# EAGLE schematic controller (EAGLE 9.6.2)

## Sheet 1 of 3
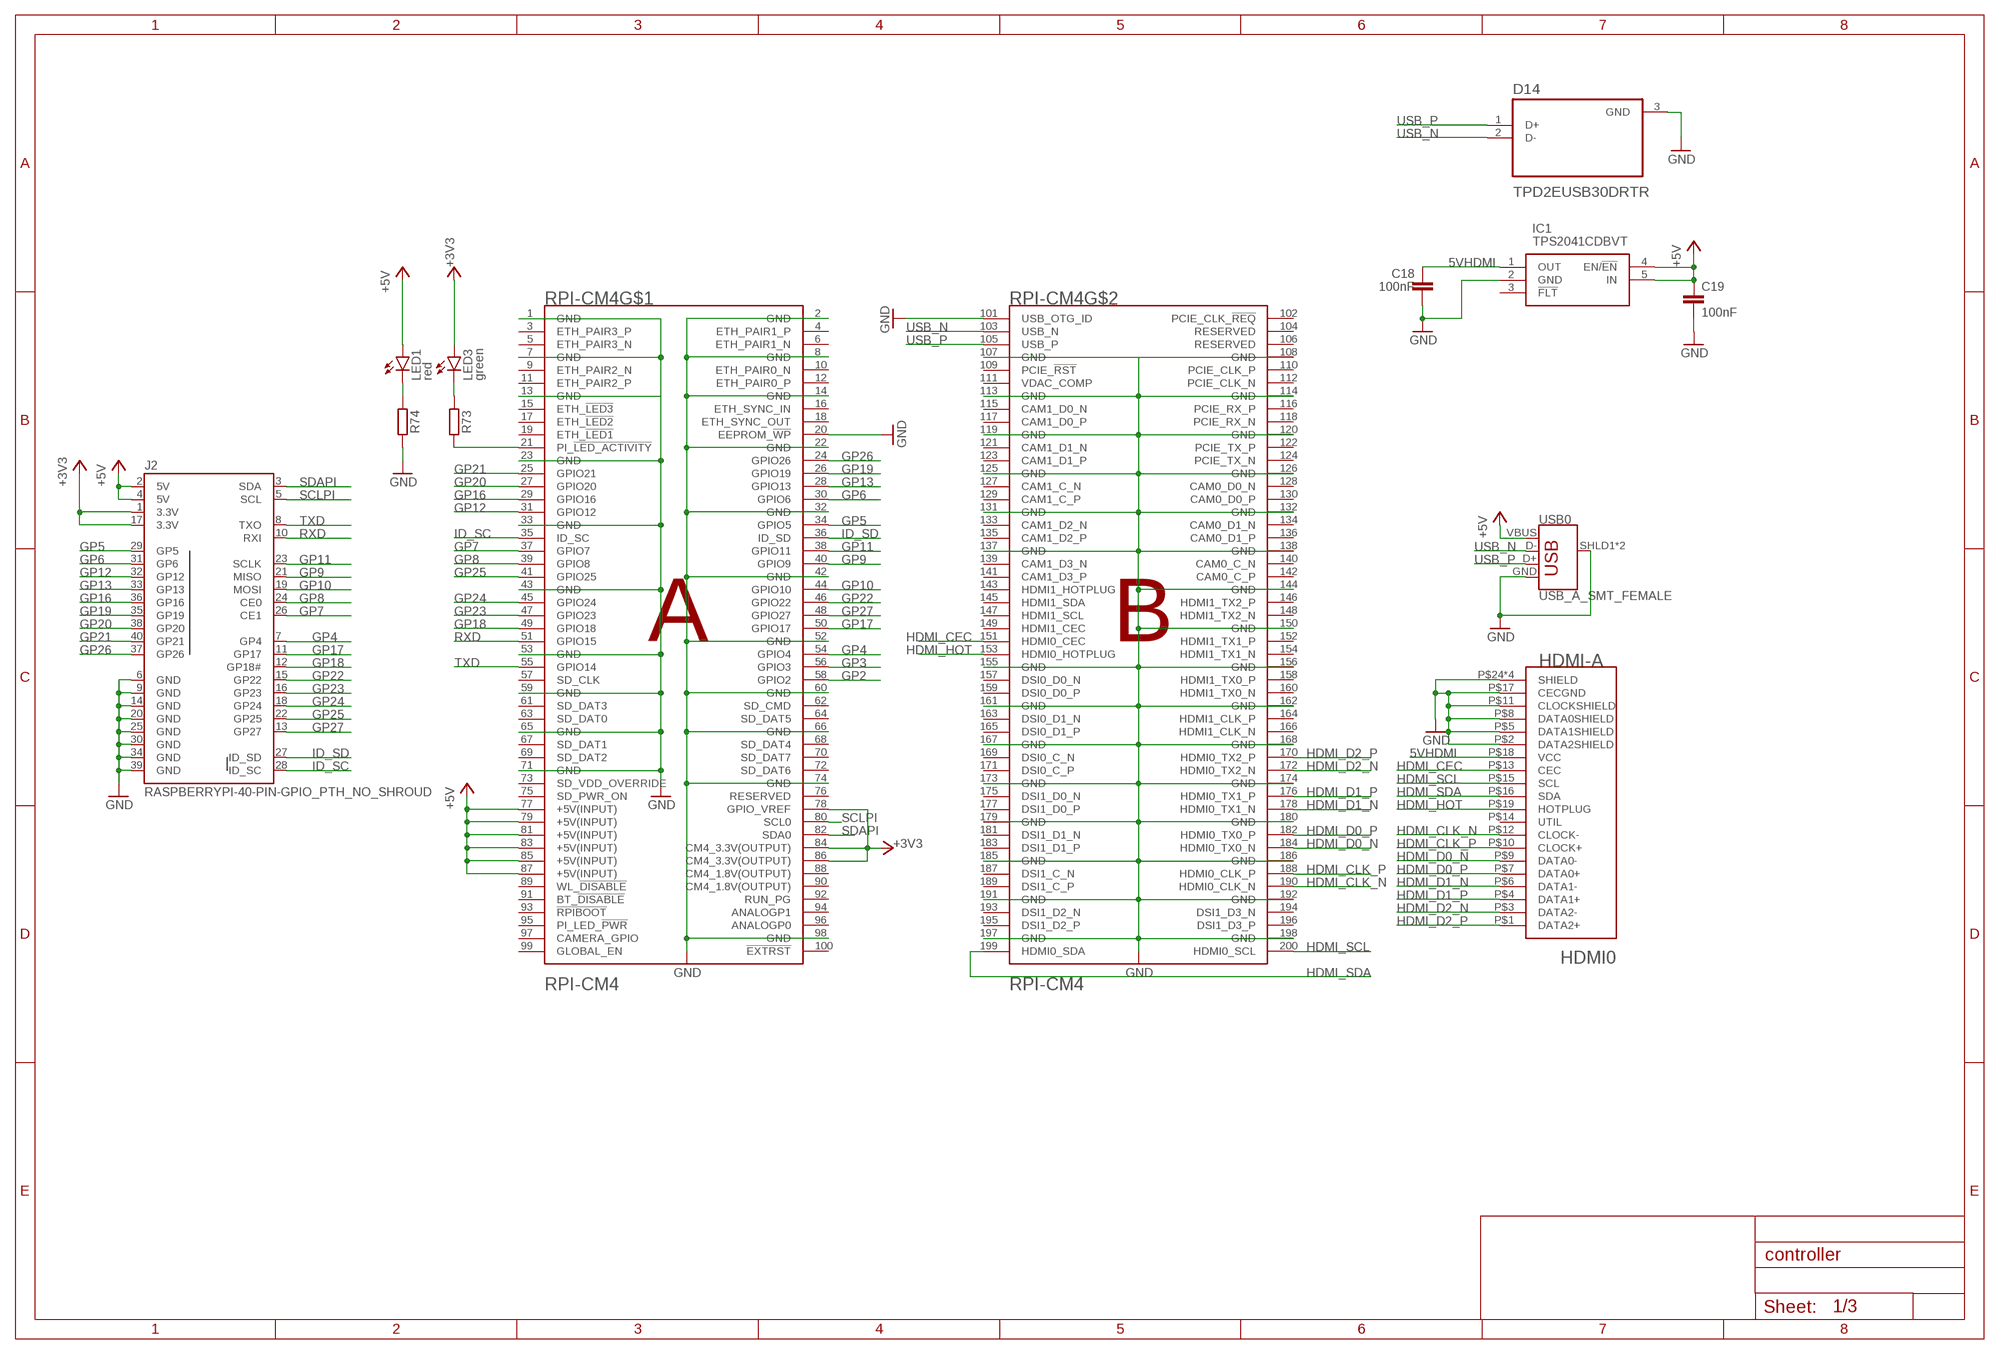
[diagram p0: schematic, sheet 1]

### Parts
C18  100nF  C-EUC0805  [C0805]
C19  100nF  C-EUC0805  [C0805]
D14  TPD2EUSB30DRTR  [SOTFL35P100X50-3N]
HDMI0  HDMI-A  [HDMI_A]
IC1  TPS2041CDBVT  [SOT95P280X145-5N]
J2  RASPBERRYPI-40-PIN-GPIO_PTH_NO_SHROUD  [2X20]
LED1  red  LEDCHIP-LED0805  [CHIP-LED0805]
LED3  green  LEDCHIP-LED0805  [CHIP-LED0805]
R73  1k  R-EU_R0805  [R0805]
R74  1k  R-EU_R0805  [R0805]
RPI-CM4  RPI-CM4  [RPI-CM4]
USB0  USB_A_SMT_FEMALE  [USB-A-S-SILK-FEMALE]

### Nets
5VHDMI: C18.1 HDMI0.P$18(VCC) IC1.1(OUT)
+3V3: J2.1(3.3V) J2.17(3.3V) LED3.A RPI-CM4.78(GPIO_VREF) RPI-CM4.84(CM4_3.3V(OUTPUT)) RPI-CM4.86(CM4_3.3V(OUTPUT)) ; also sheet 3
+5V: C19.1 IC1.4(EN/!EN) IC1.5(IN) J2.2(5V) J2.4(5V) LED1.A RPI-CM4.77(+5V(INPUT)) RPI-CM4.79(+5V(INPUT)) RPI-CM4.81(+5V(INPUT)) RPI-CM4.83(+5V(INPUT)) RPI-CM4.85(+5V(INPUT)) RPI-CM4.87(+5V(INPUT)) USB0.VBUS ; also sheet 2,3
GND: C18.2 C19.2 D14.3(GND) HDMI0.P$2(DATA2SHIELD) HDMI0.P$5(DATA1SHIELD) HDMI0.P$8(DATA0SHIELD) HDMI0.P$11(CLOCKSHIELD) HDMI0.P$17(CECGND) HDMI0.P$24(SHIELD) HDMI0.P$25(SHIELD) HDMI0.P$26(SHIELD) HDMI0.P$27(SHIELD) IC1.2(GND) J2.6(GND) J2.9(GND) J2.14(GND) J2.20(GND) J2.25(GND) J2.30(GND) J2.34(GND) J2.39(GND) R74.2 RPI-CM4.1(GND) RPI-CM4.2(GND) RPI-CM4.7(GND) RPI-CM4.8(GND) RPI-CM4.13(GND) RPI-CM4.14(GND) RPI-CM4.20(EEPROM_!WP) RPI-CM4.22(GND) RPI-CM4.23(GND) RPI-CM4.32(GND) RPI-CM4.33(GND) RPI-CM4.42(GND) RPI-CM4.43(GND) RPI-CM4.52(GND) RPI-CM4.53(GND) RPI-CM4.59(GND) RPI-CM4.60(GND) RPI-CM4.65(GND) RPI-CM4.66(GND) RPI-CM4.71(GND) RPI-CM4.74(GND) RPI-CM4.98(GND) RPI-CM4.101(USB_OTG_ID) RPI-CM4.107(GND) RPI-CM4.108(GND) RPI-CM4.113(GND) RPI-CM4.114(GND) RPI-CM4.119(GND) RPI-CM4.120(GND) RPI-CM4.125(GND) RPI-CM4.126(GND) RPI-CM4.131(GND) RPI-CM4.132(GND) RPI-CM4.137(GND) RPI-CM4.138(GND) RPI-CM4.144(GND) RPI-CM4.150(GND) RPI-CM4.155(GND) RPI-CM4.156(GND) RPI-CM4.161(GND) RPI-CM4.162(GND) RPI-CM4.167(GND) RPI-CM4.168(GND) RPI-CM4.173(GND) RPI-CM4.174(GND) RPI-CM4.179(GND) RPI-CM4.180(GND) RPI-CM4.185(GND) RPI-CM4.186(GND) RPI-CM4.191(GND) RPI-CM4.192(GND) RPI-CM4.197(GND) RPI-CM4.198(GND) USB0.GND USB0.SHLD1(SHIELD) USB0.SHLD2(SHIELD) ; also sheet 2,3
GP2: RPI-CM4.58(GPIO2)
GP3: RPI-CM4.56(GPIO3)
GP4: J2.7(GP4) RPI-CM4.54(GPIO4)
GP5: J2.29(GP5) RPI-CM4.34(GPIO5)
GP6: J2.31(GP6) RPI-CM4.30(GPIO6)
GP7: J2.26(CE1) RPI-CM4.37(GPIO7)
GP8: J2.24(CE0) RPI-CM4.39(GPIO8)
GP9: J2.21(MISO) RPI-CM4.40(GPIO9)
GP10: J2.19(MOSI) RPI-CM4.44(GPIO10)
GP11: J2.23(SCLK) RPI-CM4.38(GPIO11)
GP12: J2.32(GP12) RPI-CM4.31(GPIO12)
GP13: J2.33(GP13) RPI-CM4.28(GPIO13)
GP16: J2.36(GP16) RPI-CM4.29(GPIO16)
GP17: J2.11(GP17) RPI-CM4.50(GPIO17)
GP18: J2.12(GP18#) RPI-CM4.49(GPIO18)
GP19: J2.35(GP19) RPI-CM4.26(GPIO19)
GP20: J2.38(GP20) RPI-CM4.27(GPIO20)
GP21: J2.40(GP21) RPI-CM4.25(GPIO21)
GP22: J2.15(GP22) RPI-CM4.46(GPIO22)
GP23: J2.16(GP23) RPI-CM4.47(GPIO23) ; also sheet 3
GP24: J2.18(GP24) RPI-CM4.45(GPIO24)
GP25: J2.22(GP25) RPI-CM4.41(GPIO25)
GP26: J2.37(GP26) RPI-CM4.24(GPIO26)
GP27: J2.13(GP27) RPI-CM4.48(GPIO27)
HDMI_CEC: HDMI0.P$13(CEC) RPI-CM4.151(HDMI0_CEC)
HDMI_CLK_N [HDMI]: HDMI0.P$12(CLOCK-) RPI-CM4.190(HDMI0_CLK_N)
HDMI_CLK_P [HDMI]: HDMI0.P$10(CLOCK+) RPI-CM4.188(HDMI0_CLK_P)
HDMI_D0_N [HDMI]: HDMI0.P$9(DATA0-) RPI-CM4.184(HDMI0_TX0_N)
HDMI_D0_P [HDMI]: HDMI0.P$7(DATA0+) RPI-CM4.182(HDMI0_TX0_P)
HDMI_D1_N [HDMI]: HDMI0.P$6(DATA1-) RPI-CM4.178(HDMI0_TX1_N)
HDMI_D1_P [HDMI]: HDMI0.P$4(DATA1+) RPI-CM4.176(HDMI0_TX1_P)
HDMI_D2_N [HDMI]: HDMI0.P$3(DATA2-) RPI-CM4.172(HDMI0_TX2_N)
HDMI_D2_P [HDMI]: HDMI0.P$1(DATA2+) RPI-CM4.170(HDMI0_TX2_P)
HDMI_HOT: HDMI0.P$19(HOTPLUG) RPI-CM4.153(HDMI0_HOTPLUG)
HDMI_SCL: HDMI0.P$15(SCL) RPI-CM4.200(HDMI0_SCL)
HDMI_SDA: HDMI0.P$16(SDA) RPI-CM4.199(HDMI0_SDA)
ID_SC: J2.28(ID_SC) RPI-CM4.35(ID_SC)
ID_SD: J2.27(ID_SD) RPI-CM4.36(ID_SD)
N$4: R73.2 RPI-CM4.21(PI_!LED_ACTIVITY)
N$23: LED3.C R73.1
N$32: LED1.C R74.1
RXD: J2.10(RXI) RPI-CM4.51(GPIO15) ; also sheet 3
SCLPI: J2.5(SCL) RPI-CM4.80(SCL0)
SDAPI: J2.3(SDA) RPI-CM4.82(SDA0)
TXD: J2.8(TXO) RPI-CM4.55(GPIO14) ; also sheet 3
USB_N [USB]: D14.2(D-) RPI-CM4.103(USB_N) USB0.D-
USB_P [USB]: D14.1(D+) RPI-CM4.105(USB_P) USB0.D+
Unconnected: HDMI0.P$14(UTIL) IC1.3(!FLT) RPI-CM4.3(ETH_PAIR3_P) RPI-CM4.4(ETH_PAIR1_P) RPI-CM4.5(ETH_PAIR3_N) RPI-CM4.6(ETH_PAIR1_N) RPI-CM4.9(ETH_PAIR2_N) RPI-CM4.10(ETH_PAIR0_N) RPI-CM4.11(ETH_PAIR2_P) RPI-CM4.12(ETH_PAIR0_P) RPI-CM4.15(ETH_!LED3) RPI-CM4.16(ETH_SYNC_IN) RPI-CM4.17(ETH_!LED2) RPI-CM4.18(ETH_SYNC_OUT) RPI-CM4.19(ETH_!LED1) RPI-CM4.57(SD_CLK) RPI-CM4.61(SD_DAT3) RPI-CM4.62(SD_CMD) RPI-CM4.63(SD_DAT0) RPI-CM4.64(SD_DAT5) RPI-CM4.67(SD_DAT1) RPI-CM4.68(SD_DAT4) RPI-CM4.69(SD_DAT2) RPI-CM4.70(SD_DAT7) RPI-CM4.72(SD_DAT6) RPI-CM4.73(SD_VDD_OVERRIDE) RPI-CM4.75(SD_PWR_ON) RPI-CM4.76(RESERVED) RPI-CM4.88(CM4_1.8V(OUTPUT)) RPI-CM4.89(WL_!DISABLE) RPI-CM4.90(CM4_1.8V(OUTPUT)) RPI-CM4.91(BT_!DISABLE) RPI-CM4.92(RUN_PG) RPI-CM4.93(!RPIBOOT) RPI-CM4.94(ANALOGP1) RPI-CM4.95(PI_LED_!PWR) RPI-CM4.96(ANALOGP0) RPI-CM4.97(CAMERA_GPIO) RPI-CM4.99(GLOBAL_EN) RPI-CM4.100(!EXTRST) RPI-CM4.102(PCIE_CLK_!REQ) RPI-CM4.104(RESERVED) RPI-CM4.106(RESERVED) RPI-CM4.109(PCIE_!RST) RPI-CM4.110(PCIE_CLK_P) RPI-CM4.111(VDAC_COMP) RPI-CM4.112(PCIE_CLK_N) RPI-CM4.115(CAM1_D0_N) RPI-CM4.116(PCIE_RX_P) RPI-CM4.117(CAM1_D0_P) RPI-CM4.118(PCIE_RX_N) RPI-CM4.121(CAM1_D1_N) RPI-CM4.122(PCIE_TX_P) RPI-CM4.123(CAM1_D1_P) RPI-CM4.124(PCIE_TX_N) RPI-CM4.127(CAM1_C_N) RPI-CM4.128(CAM0_D0_N) RPI-CM4.129(CAM1_C_P) RPI-CM4.130(CAM0_D0_P) RPI-CM4.133(CAM1_D2_N) RPI-CM4.134(CAM0_D1_N) RPI-CM4.135(CAM1_D2_P) RPI-CM4.136(CAM0_D1_P) RPI-CM4.139(CAM1_D3_N) RPI-CM4.140(CAM0_C_N) RPI-CM4.141(CAM1_D3_P) RPI-CM4.142(CAM0_C_P) RPI-CM4.143(HDMI1_HOTPLUG) RPI-CM4.145(HDMI1_SDA) RPI-CM4.146(HDMI1_TX2_P) RPI-CM4.147(HDMI1_SCL) RPI-CM4.148(HDMI1_TX2_N) RPI-CM4.149(HDMI1_CEC) RPI-CM4.152(HDMI1_TX1_P) RPI-CM4.154(HDMI1_TX1_N) RPI-CM4.157(DSI0_D0_N) RPI-CM4.158(HDMI1_TX0_P) RPI-CM4.159(DSI0_D0_P) RPI-CM4.160(HDMI1_TX0_N) RPI-CM4.163(DSI0_D1_N) RPI-CM4.164(HDMI1_CLK_P) RPI-CM4.165(DSI0_D1_P) RPI-CM4.166(HDMI1_CLK_N) RPI-CM4.169(DSI0_C_N) RPI-CM4.171(DSI0_C_P) RPI-CM4.175(DSI1_D0_N) RPI-CM4.177(DSI1_D0_P) RPI-CM4.181(DSI1_D1_N) RPI-CM4.183(DSI1_D1_P) RPI-CM4.187(DSI1_C_N) RPI-CM4.189(DSI1_C_P) RPI-CM4.193(DSI1_D2_N) RPI-CM4.194(DSI1_D3_N) RPI-CM4.195(DSI1_D2_P) RPI-CM4.196(DSI1_D3_P)

## Sheet 2 of 3
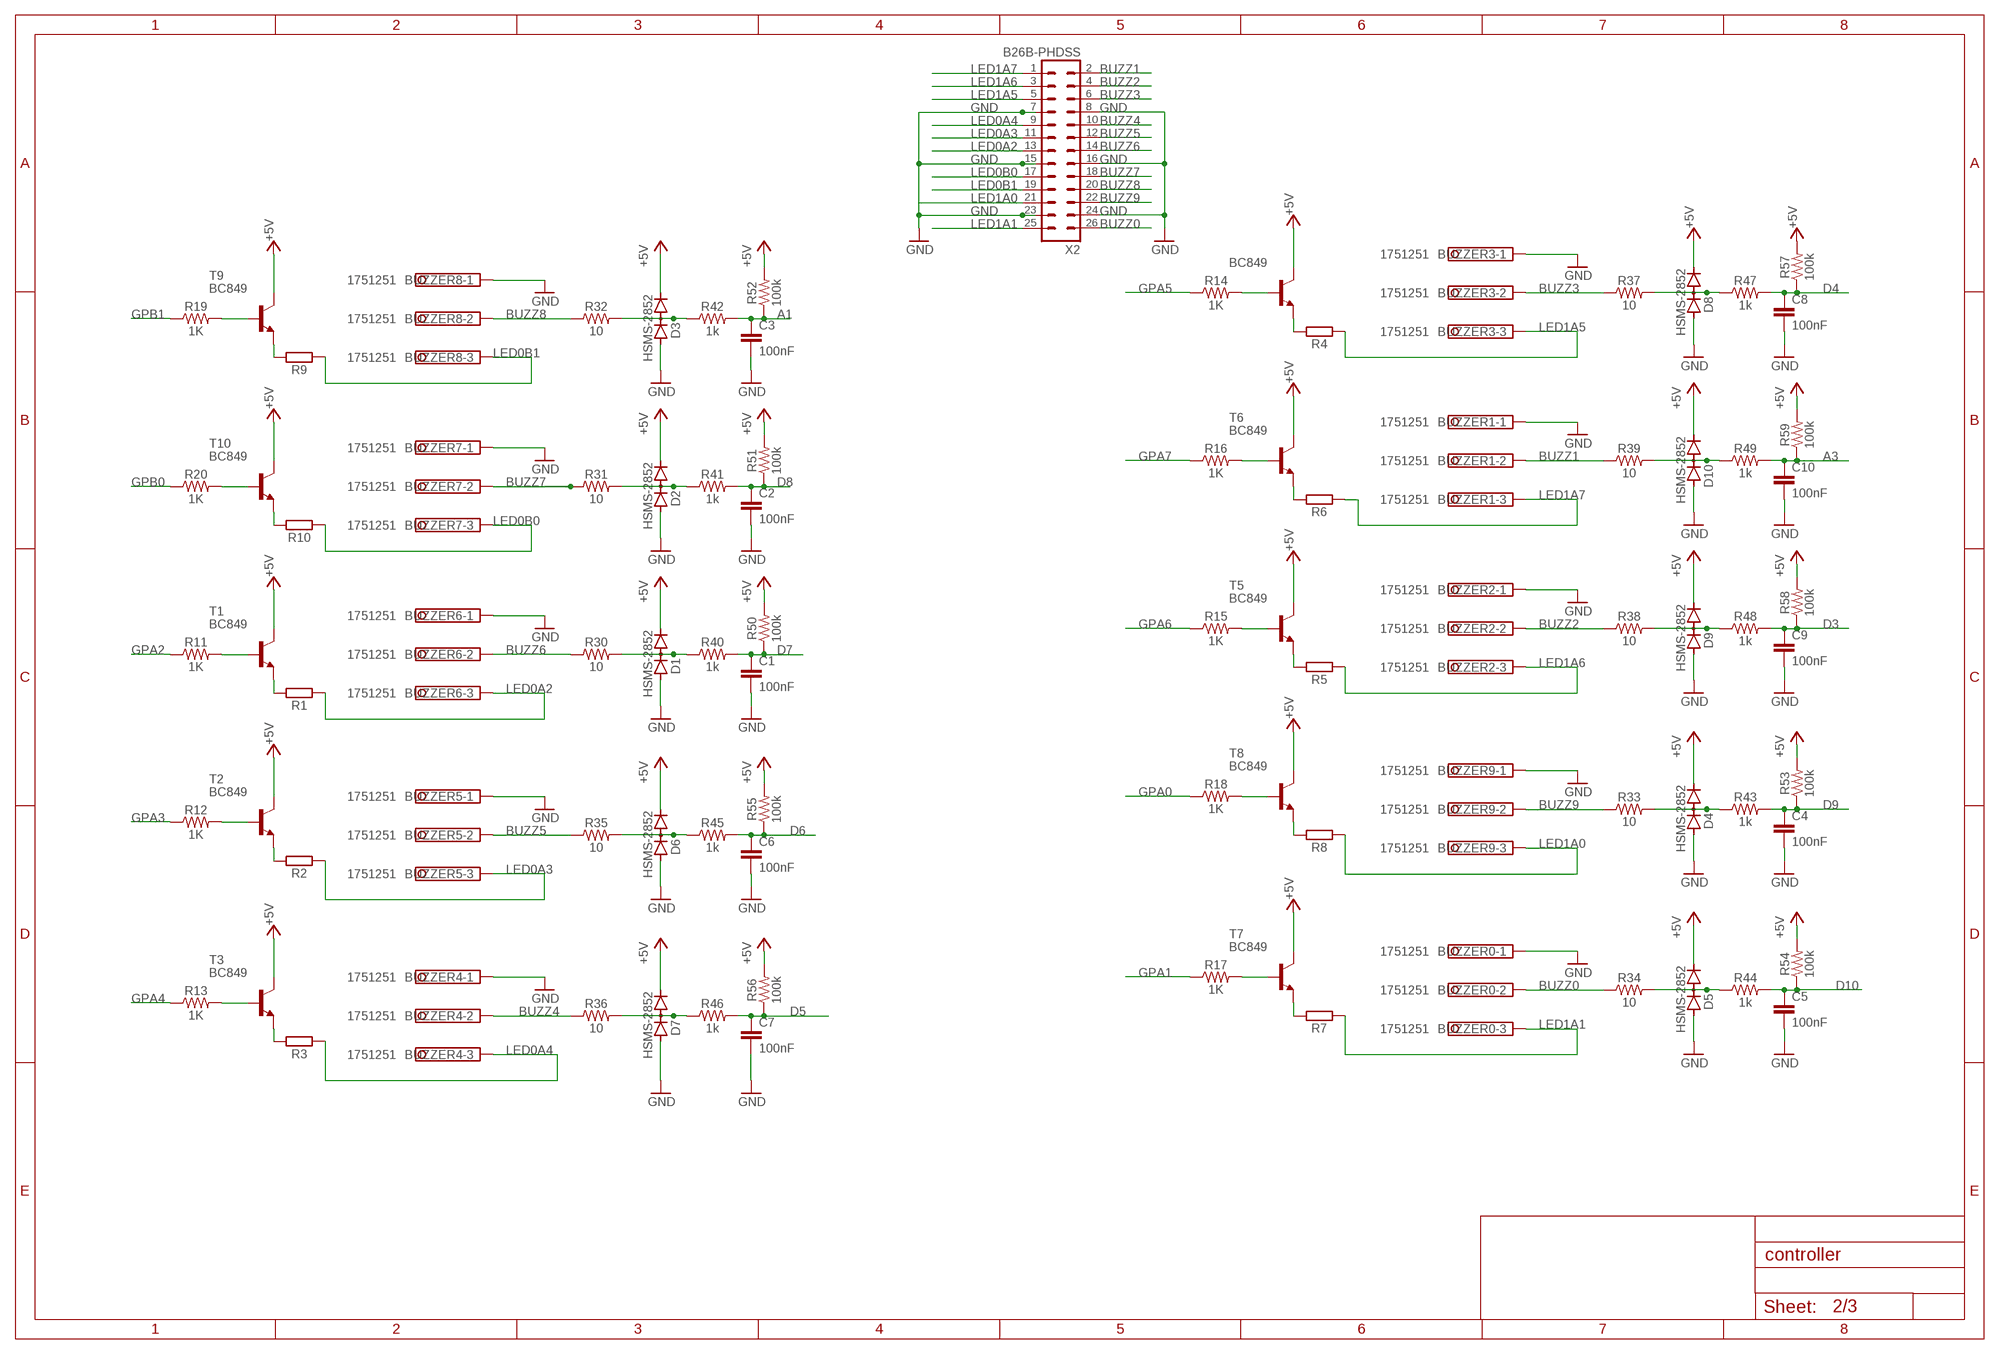
[diagram p1: schematic, sheet 2]

### Parts
BUZZER0  1751251  [1751251]
BUZZER1  1751251  [1751251]
BUZZER2  1751251  [1751251]
BUZZER3  1751251  [1751251]
BUZZER4  1751251  [1751251]
BUZZER5  1751251  [1751251]
BUZZER6  1751251  [1751251]
BUZZER7  1751251  [1751251]
BUZZER8  1751251  [1751251]
BUZZER9  1751251  [1751251]
C1  100nF  C-EUC0805  [C0805]
C2  100nF  C-EUC0805  [C0805]
C3  100nF  C-EUC0805  [C0805]
C4  100nF  C-EUC0805  [C0805]
C5  100nF  C-EUC0805  [C0805]
C6  100nF  C-EUC0805  [C0805]
C7  100nF  C-EUC0805  [C0805]
C8  100nF  C-EUC0805  [C0805]
C9  100nF  C-EUC0805  [C0805]
C10  100nF  C-EUC0805  [C0805]
D1  HSMS-2852  [SOT23]
D2  HSMS-2852  [SOT23]
D3  HSMS-2852  [SOT23]
D4  HSMS-2852  [SOT23]
D5  HSMS-2852  [SOT23]
D6  HSMS-2852  [SOT23]
D7  HSMS-2852  [SOT23]
D8  HSMS-2852  [SOT23]
D9  HSMS-2852  [SOT23]
D10  HSMS-2852  [SOT23]
R1  50  R-EU_R2512  [R2512]
R2  50  R-EU_R2512  [R2512]
R3  50  R-EU_R2512  [R2512]
R4  50  R-EU_R2512  [R2512]
R5  50  R-EU_R2512  [R2512]
R6  50  R-EU_R2512  [R2512]
R7  50  R-EU_R2512  [R2512]
R8  50  R-EU_R2512  [R2512]
R9  50  R-EU_R2512  [R2512]
R10  50  R-EU_R2512  [R2512]
R11  1K  RESISTOR0805  [0805]
R12  1K  RESISTOR0805  [0805]
R13  1K  RESISTOR0805  [0805]
R14  1K  RESISTOR0805  [0805]
R15  1K  RESISTOR0805  [0805]
R16  1K  RESISTOR0805  [0805]
R17  1K  RESISTOR0805  [0805]
R18  1K  RESISTOR0805  [0805]
R19  1K  RESISTOR0805  [0805]
R20  1K  RESISTOR0805  [0805]
R30  10  RESISTOR0805  [0805]
R31  10  RESISTOR0805  [0805]
R32  10  RESISTOR0805  [0805]
R33  10  RESISTOR0805  [0805]
R34  10  RESISTOR0805  [0805]
R35  10  RESISTOR0805  [0805]
R36  10  RESISTOR0805  [0805]
R37  10  RESISTOR0805  [0805]
R38  10  RESISTOR0805  [0805]
R39  10  RESISTOR0805  [0805]
R40  1k  RESISTOR0805  [0805]
R41  1k  RESISTOR0805  [0805]
R42  1k  RESISTOR0805  [0805]
R43  1k  RESISTOR0805  [0805]
R44  1k  RESISTOR0805  [0805]
R45  1k  RESISTOR0805  [0805]
R46  1k  RESISTOR0805  [0805]
R47  1k  RESISTOR0805  [0805]
R48  1k  RESISTOR0805  [0805]
R49  1k  RESISTOR0805  [0805]
R50  100k  RESISTOR0805  [0805]
R51  100k  RESISTOR0805  [0805]
R52  100k  RESISTOR0805  [0805]
R53  100k  RESISTOR0805  [0805]
R54  100k  RESISTOR0805  [0805]
R55  100k  RESISTOR0805  [0805]
R56  100k  RESISTOR0805  [0805]
R57  100k  RESISTOR0805  [0805]
R58  100k  RESISTOR0805  [0805]
R59  100k  RESISTOR0805  [0805]
T1  BC849  [SOT23]
T2  BC849  [SOT23]
T3  BC849  [SOT23]
T4  BC849  [SOT23]
T5  BC849  [SOT23]
T6  BC849  [SOT23]
T7  BC849  [SOT23]
T8  BC849  [SOT23]
T9  BC849  [SOT23]
T10  BC849  [SOT23]
X2  B26B-PHDSS  [B26B-PHDSS]

### Nets
+5V: D1.2(C) D2.2(C) D3.2(C) D4.2(C) D5.2(C) D6.2(C) D7.2(C) D8.2(C) D9.2(C) D10.2(C) R50.2 R51.2 R52.2 R53.2 R54.2 R55.2 R56.2 R57.2 R58.2 R59.2 T1.3(C) T2.3(C) T3.3(C) T4.3(C) T5.3(C) T6.3(C) T7.3(C) T8.3(C) T9.3(C) T10.3(C) ; also sheet 1,3
A1: C3.1 R42.2 R52.1 ; also sheet 3
A3: C10.1 R49.2 R59.1 ; also sheet 3
BUZZ0: BUZZER0.2 R34.1 X2.26
BUZZ1: BUZZER1.2 R39.1 X2.2
BUZZ2: BUZZER2.2 R38.1 X2.4
BUZZ3: BUZZER3.2 R37.1 X2.6
BUZZ4: BUZZER4.2 R36.1 X2.10
BUZZ5: BUZZER5.2 R35.1 X2.12
BUZZ6: BUZZER6.2 R30.1 X2.14
BUZZ7: BUZZER7.2 R31.1 X2.18
BUZZ8: BUZZER8.2 R32.1 X2.20
BUZZ9: BUZZER9.2 R33.1 X2.22
D3: C9.1 R48.2 R58.1 ; also sheet 3
D4: C8.1 R47.2 R57.1 ; also sheet 3
D5: C7.1 R46.2 R56.1 ; also sheet 3
D6: C6.1 R45.2 R55.1 ; also sheet 3
D7: C1.1 R40.2 R50.1 ; also sheet 3
D8: C2.1 R41.2 R51.1 ; also sheet 3
D9: C4.1 R43.2 R53.1 ; also sheet 3
D10: C5.1 R44.2 R54.1 ; also sheet 3
GND: BUZZER0.1 BUZZER1.1 BUZZER2.1 BUZZER3.1 BUZZER4.1 BUZZER5.1 BUZZER6.1 BUZZER7.1 BUZZER8.1 BUZZER9.1 C1.2 C2.2 C3.2 C4.2 C5.2 C6.2 C7.2 C8.2 C9.2 C10.2 D1.1(A) D2.1(A) D3.1(A) D4.1(A) D5.1(A) D6.1(A) D7.1(A) D8.1(A) D9.1(A) D10.1(A) X2.7 X2.8 X2.15 X2.16 X2.23 X2.24 ; also sheet 1,3
GPA0: R18.1 ; also sheet 3
GPA1: R17.1 ; also sheet 3
GPA2: R11.1 ; also sheet 3
GPA3: R12.1 ; also sheet 3
GPA4: R13.1 ; also sheet 3
GPA5: R14.1 ; also sheet 3
GPA6: R15.1 ; also sheet 3
GPA7: R16.1 ; also sheet 3
GPB0: R20.1 ; also sheet 3
GPB1: R19.1 ; also sheet 3
LED0A2: BUZZER6.3 R1.1 X2.13
LED0A3: BUZZER5.3 R2.1 X2.11
LED0A4: BUZZER4.3 R3.1 X2.9
LED0B0: BUZZER7.3 R10.1 X2.17
LED0B1: BUZZER8.3 R9.1 X2.19
LED1A0: BUZZER9.3 R8.1 X2.21
LED1A1: BUZZER0.3 R7.1 X2.25
LED1A5: BUZZER3.3 R4.1 X2.5
LED1A6: BUZZER2.3 R5.1 X2.3
LED1A7: BUZZER1.3 R6.1 X2.1
N$1: R14.2 T4.1(B)
N$2: R4.2 T4.2(E)
N$3: D3.3(AC) R32.2 R42.1
N$5: R16.2 T6.1(B)
N$6: D2.3(AC) R31.2 R41.1
N$7: D8.3(AC) R37.2 R47.1
N$8: R6.2 T6.2(E)
N$9: D1.3(AC) R30.2 R40.1
N$10: R15.2 T5.1(B)
N$11: R5.2 T5.2(E)
N$12: D6.3(AC) R35.2 R45.1
N$13: D10.3(AC) R39.2 R49.1
N$14: R18.2 T8.1(B)
N$15: D7.3(AC) R36.2 R46.1
N$16: R8.2 T8.2(E)
N$17: D9.3(AC) R38.2 R48.1
N$18: R17.2 T7.1(B)
N$19: D4.3(AC) R33.2 R43.1
N$20: R7.2 T7.2(E)
N$21: R19.2 T9.1(B)
N$22: R9.2 T9.2(E)
N$24: R20.2 T10.1(B)
N$25: R10.2 T10.2(E)
N$26: R11.2 T1.1(B)
N$27: R1.2 T1.2(E)
N$28: R12.2 T2.1(B)
N$29: R2.2 T2.2(E)
N$30: R13.2 T3.1(B)
N$31: R3.2 T3.2(E)
N$34: D5.3(AC) R34.2 R44.1

## Sheet 3 of 3
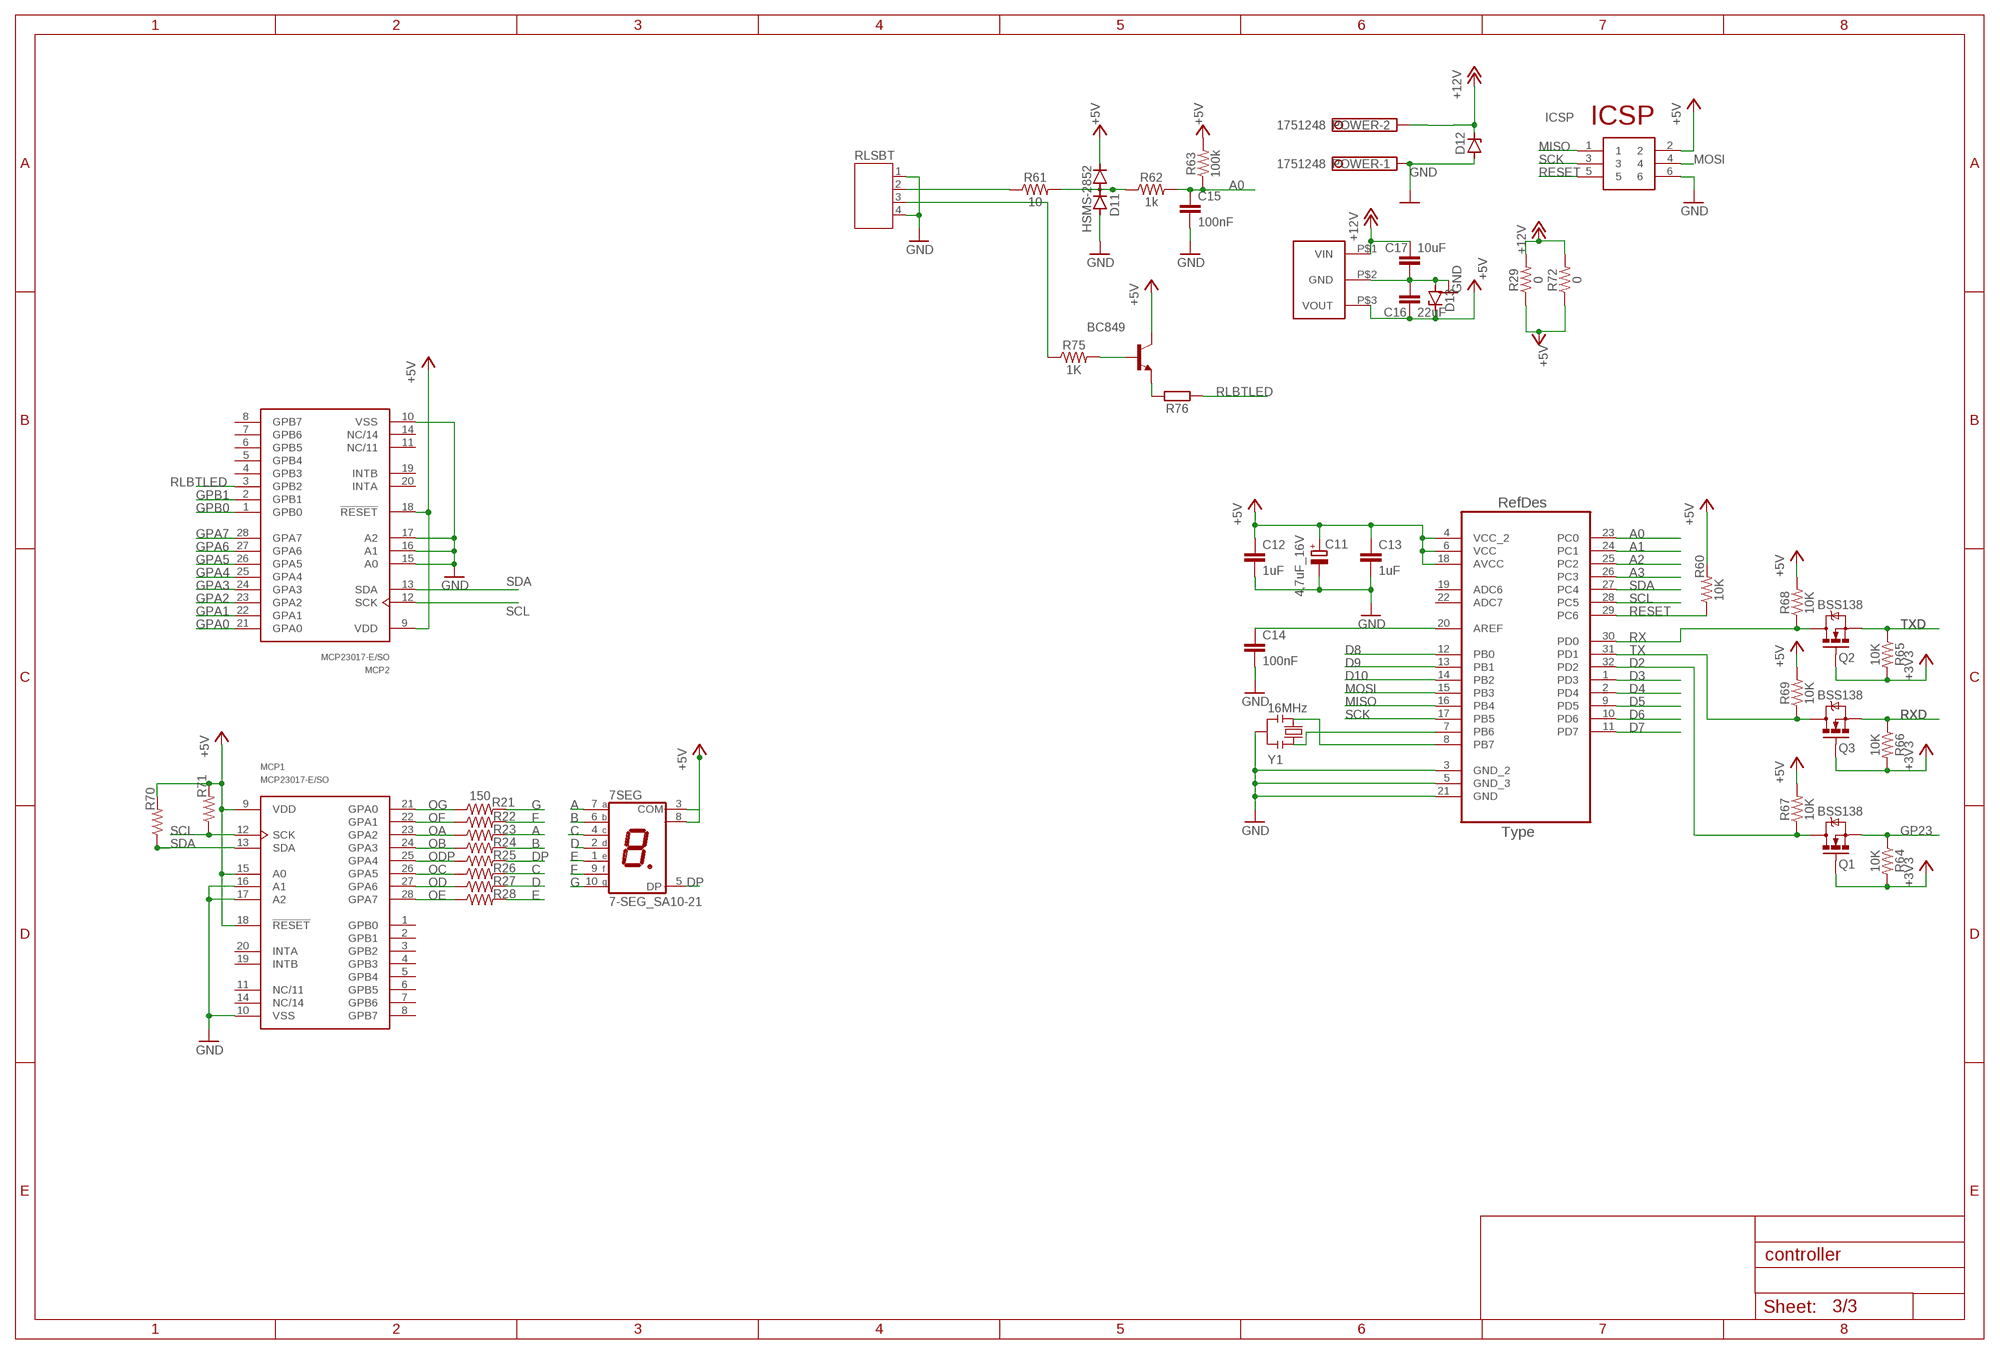
[diagram p2: schematic, sheet 3]

### Parts
7SEG  7-SEG_SA10-21  [SA10-21]
C11  4,7uF_16V  0833_TAJA475MO16RNJ  [TAN-A]
C12  1uF  0006_1UF_0603/GRM188R61E105KA12D  [C0603-ROUND]
C13  1uF  0006_1UF_0603/GRM188R61E105KA12D  [C0603-ROUND]
C14  100nF  0015_100NF_0603  [C0603-ROUND]
C15  100nF  C-EUC0805  [C0805]
C16  22uF  C-EUC0805  [C0805]
C17  10uF  C-EUC0805  [C0805]
D11  HSMS-2852  [SOT23]
D12  ZENER-DIODESMB  [SMB]
D13  ZENER-DIODESMB  [SMB]
ICSP  61200621621  [SHDR6W64P254_2X3_1528X910X910P]
MCP1  MCP23017-E/SO  [SOIC28]
MCP2  MCP23017-E/SO  [SOIC28]
POWER  1751248  [1751248]
Q1  BSS138  MOSFET-NCHANNELSMD  [SOT23-3]
Q2  BSS138  MOSFET-NCHANNELSMD  [SOT23-3]
Q3  BSS138  MOSFET-NCHANNELSMD  [SOT23-3]
R21  150  RESISTOR0805  [0805]
R22  150  RESISTOR0805  [0805]
R23  150  RESISTOR0805  [0805]
R24  150  RESISTOR0805  [0805]
R25  150  RESISTOR0805  [0805]
R26  150  RESISTOR0805  [0805]
R27  150  RESISTOR0805  [0805]
R28  150  RESISTOR0805  [0805]
R29  0  RESISTOR0805  [0805]
R60  10K  RESISTOR0805  [0805]
R61  10  RESISTOR0805  [0805]
R62  1k  RESISTOR0805  [0805]
R63  100k  RESISTOR0805  [0805]
R64  10K  RESISTOR0805  [0805]
R65  10K  RESISTOR0805  [0805]
R66  10K  RESISTOR0805  [0805]
R67  10K  RESISTOR0805  [0805]
R68  10K  RESISTOR0805  [0805]
R69  10K  RESISTOR0805  [0805]
R70  RESISTOR0805  [0805]
R71  RESISTOR0805  [0805]
R72  0  RESISTOR0805  [0805]
R75  1K  RESISTOR0805  [0805]
R76  50  R-EU_R2512  [R2512]
RLSBT  JST-PH4  [JST-PH4]
T11  BC849  [SOT23]
U1  ATMEGA328P-AU  [QFP80P900X900X120-32N]
U$5  GAPTECCLC78  [GAPTECLC78]
Y1  16MHz  0011_CSTCE16M0V53-R0  [RESONATOR]

### Nets
+3V3: Q1.1(G) Q2.1(G) Q3.1(G) R64.2 R65.2 R66.2 ; also sheet 1
+5V: 7SEG.3(COM) 7SEG.8(COM) C11.1(+) C12.1 C13.1 C16.2 D11.2(C) D13.C ICSP.2 MCP1.9(VDD) MCP1.15(A0) MCP1.18(!RESET) MCP2.9(VDD) MCP2.18(!RESET) R29.1 R60.2 R63.2 R67.2 R68.2 R69.2 R70.2 R71.2 R72.1 T11.3(C) U1.4(VCC_2) U1.6(VCC) U1.18(AVCC) U$5.P$3(VOUT) ; also sheet 1,2
+12V: C17.1 D12.C POWER.2 R29.2 R72.2 U$5.P$1(VIN)
A: 7SEG.7(A) R23.2
A0: C15.1 R62.2 R63.1 U1.23(PC0)
A1: U1.24(PC1) ; also sheet 2
A2: U1.25(PC2)
A3: U1.26(PC3) ; also sheet 2
B: 7SEG.6(B) R24.2
C: 7SEG.4(C) R26.2
D: 7SEG.2(D) R27.2
D2: Q1.3(D) R67.1 U1.32(PD2)
D3: U1.1(PD3) ; also sheet 2
D4: U1.2(PD4) ; also sheet 2
D5: U1.9(PD5) ; also sheet 2
D6: U1.10(PD6) ; also sheet 2
D7: U1.11(PD7) ; also sheet 2
D8: U1.12(PB0) ; also sheet 2
D9: U1.13(PB1) ; also sheet 2
D10: U1.14(PB2) ; also sheet 2
DP: 7SEG.5(DP) R25.2
E: 7SEG.1(E) R28.2
F: 7SEG.9(F) R22.2
G: 7SEG.10(G) R21.2
GND: C11.2(-) C12.2 C13.2 C14.2 C15.2 C16.1 C17.2 D11.1(A) D12.A D13.A ICSP.6 MCP1.10(VSS) MCP1.16(A1) MCP1.17(A2) MCP2.10(VSS) MCP2.15(A0) MCP2.16(A1) MCP2.17(A2) POWER.1 RLSBT.1 RLSBT.4 U1.3(GND_2) U1.5(GND_3) U1.21(GND) U$5.P$2(GND) Y1.2 ; also sheet 1,2
GP23: Q1.2(S) R64.1 ; also sheet 1
GPA0: MCP2.21(GPA0) ; also sheet 2
GPA1: MCP2.22(GPA1) ; also sheet 2
GPA2: MCP2.23(GPA2) ; also sheet 2
GPA3: MCP2.24(GPA3) ; also sheet 2
GPA4: MCP2.25(GPA4) ; also sheet 2
GPA5: MCP2.26(GPA5) ; also sheet 2
GPA6: MCP2.27(GPA6) ; also sheet 2
GPA7: MCP2.28(GPA7) ; also sheet 2
GPB0: MCP2.1(GPB0) ; also sheet 2
GPB1: MCP2.2(GPB1) ; also sheet 2
MISO: ICSP.1 U1.16(PB4)
MOSI: ICSP.4 U1.15(PB3)
N$33: U1.8(PB7) Y1.3
N$35: R75.2 T11.1(B)
N$36: R76.2 T11.2(E)
N$37: R75.1 RLSBT.3
N$41: D11.3(AC) R61.2 R62.1
N$43: U1.7(PB6) Y1.1
N$44: C14.1 U1.20(AREF)
OA: MCP1.23(GPA2) R23.1
OB: MCP1.24(GPA3) R24.1
OC: MCP1.26(GPA5) R26.1
OD: MCP1.27(GPA6) R27.1
ODP: MCP1.25(GPA4) R25.1
OE: MCP1.28(GPA7) R28.1
OF: MCP1.22(GPA1) R22.1
OG: MCP1.21(GPA0) R21.1
RESET: ICSP.5 R60.1 U1.29(PC6)
RLBTLED: MCP2.3(GPB2) R76.1
RLSBT: R61.1 RLSBT.2
RX: Q2.3(D) R68.1 U1.30(PD0)
RXD: Q3.2(S) R66.1 ; also sheet 1
SCK: ICSP.3 U1.17(PB5)
SCL: MCP1.12(SCK) MCP2.12(SCK) R71.1 U1.28(PC5)
SDA: MCP1.13(SDA) MCP2.13(SDA) R70.1 U1.27(PC4)
TX: Q3.3(D) R69.1 U1.31(PD1)
TXD: Q2.2(S) R65.1 ; also sheet 1
Unconnected: MCP1.1(GPB0) MCP1.2(GPB1) MCP1.3(GPB2) MCP1.4(GPB3) MCP1.5(GPB4) MCP1.6(GPB5) MCP1.7(GPB6) MCP1.8(GPB7) MCP1.11(NC/11) MCP1.14(NC/14) MCP1.19(INTB) MCP1.20(INTA) MCP2.4(GPB3) MCP2.5(GPB4) MCP2.6(GPB5) MCP2.7(GPB6) MCP2.8(GPB7) MCP2.11(NC/11) MCP2.14(NC/14) MCP2.19(INTB) MCP2.20(INTA) U1.19(ADC6) U1.22(ADC7)

### Notes on the sheet
- ICSP

## Library data of the parts
7SEG = display-kingbright:7-SEG_: Kingbright 14.2mm (0.56 INCH) SINGLE DIGIT NUMERIC DUISPLAY Source: SA56-11EWA(Ver1189471036.pdf; OC_FARNELL: unknown; OC_NEWARK: unknown
BUZZER0 BUZZER1-BUZZER9 = custom-350:1751251: MKDS 1/ 3-3,5 Printklemme Nennstrom: 10 A Bemessungsspannung: 160 V Raster: 3,5 mm Polzahl: 3 Montageart: Löten Anschlussart: Schraubanschluss Anschlussrichtung vom Leiter zur Platine: 0° Source: http://eshop.phoenixcontact.com .. 1751251.pdf; OC_FARNELL: unknown; OC_NEWARK: unknown
C1-C10 C15-C19 = rcl:C-EU: CAPACITOR, European symbol; SPICEPREFIX: C
C11 = Condensatori:0833_TAJA475MO16RNJ: 4,7uF; CASE: Case_A_(1206); MONTHLY_USAGE: _____; PART_NUMBER: TAJA475MO16RNJ; PRICE: _____; SUPPLIER: _____; TYPE: Condensatori
C12 C13 = Condensatori:0006_1UF_0603/GRM188R61E105KA12D: 1uF 0603; CASE: 0603; MONTHLY_USAGE: _____; PART_NUMBER: 1uF_0603/GRM188R61E105KA12D; PRICE: _____; SUPPLIER: _____; TYPE: Condensatori
C14 = Condensatori:0015_100NF_0603: 100nF 0603 50V; CASE: 0603; MONTHLY_USAGE: _____; PART_NUMBER: cl10b104kbnc; PRICE: _____; SUPPLIER: _____; TYPE: Condensatori
D1-D11 = avago:HSMS-2852: Surface Mount Microwave Schottky Detector Diodes Source: Data sheet <http://www.farnell.com/datasheets/461166.pdf>
D12 D13 = diode:ZENER-DIODE: Z-Diode
D14 = TPD2EUSB30DRTR:TPD2EUSB30DRTR; DESCRIPTION: 2-channel ESD solution for SuperSpeed USB 3.0 interface 3-SOT-9X3 -40 to 85; DIGI-KEY_PART_NUMBER: 296-25509-1-ND; MF: Texas Instruments; MP: TPD2EUSB30DRTR; PACKAGE: SOT-9X3-3 Texas Instruments; PURCHASE-URL: https://pricing.snapeda.com/search/part/TPD2EUSB30DRTR/?ref=eda
HDMI0 = connectors:HDMI-A: Horizonal HDMI type "A" jack
IC1 = SamacSys_Parts:TPS2041CDBVT: Texas Instruments TPS2041CDBVT Digital Power Switch IC, Power Distribution, 0.5A, 4.5 5.5V, 5-Pin, SOT-23 Source: Datasheet <http://www.ti.com/lit/gpn/tps2041c>; DESCRIPTION: Texas Instruments TPS2041CDBVT Digital Power Switch IC, Power Distribution, 0.5A, 4.5 5.5V, 5-Pin, SOT-23; HEIGHT: 1.45mm; MANUFACTURER_NAME: Texas Instruments; MANUFACTURER_PART_NUMBER: TPS2041CDBVT; MOUSER_PART_NUMBER: 595-TPS2041CDBVT; MOUSER_PRICE-STOCK: https://www.mouser.co.uk/ProductDetail/Texas-Instruments/TPS2041CDBVT?qs=jUogulkOmlah9k1%252BY0WftQ%3D%3D
ICSP = SamacSys_Parts:61200621621: Wurth Elektronik PCB Header WR-BHD, 6 Way, 2.54mm Pitch, 2 Row, Straight, Through Hole Source: Datasheet <https://katalog.we-online.de/em/datasheet/6120xx21621.pdf>; DESCRIPTION: Wurth Elektronik PCB Header WR-BHD, 6 Way, 2.54mm Pitch, 2 Row, Straight, Through Hole; HEIGHT: 9.1mm; MANUFACTURER_NAME: Wurth Elektronik; MANUFACTURER_PART_NUMBER: 61200621621; MOUSER_PART_NUMBER: 710-61200621621; MOUSER_PRICE-STOCK: https://www.mouser.co.uk/ProductDetail/Wurth-Elektronik/61200621621?qs=PhR8RmCirEbjX8n1RKw4Jw%3D%3D
J2 = Custom-Connector:RASPBERRYPI-40-PIN-GPIO: Raspberry Pi GPIO Header 2x20 pin connector, as found on B, B+, A+ models. Both shrouded PTH and SMT versions available. SparkFun Products: GPIO Shrouded Header <https://www.sparkfun.com/products/13054>- PTH SparkFun Pi Wedge (Preassembled) <https://www.sparkfun.com/products/13717>
LED1 LED3 = led:LED: LED OSRAM: - CHIPLED LG R971, LG N971, LY N971, LG Q971, LY Q971, LO R971, LY R971 LH N974, LH R974 LS Q976, LO Q976, LY Q976 LO Q996 - Hyper CHIPLED LW Q18S LB Q993, LB Q99A, LB R99A - SideLED LS A670, LO A670, LY A670, LG A670, LP A670 LB A673, LV A673, LT A673, LW A673 LH A674 LY A675 LS A676, LA A676, LO A676, LY A676, LW A676 LS A679, LY A679, LG A679 - Hyper Micro SIDELED® LS Y876, LA Y876, LO Y876, LY Y876 LT Y87S - SmartLED LW L88C, LW L88S LB L89C, LB L89S, LG L890 LS L89K, LO L89K, LY L89K LS L896, LA L896, LO L896, LY L896 - TOPLED LS T670, LO T670, LY T670, LG T670, LP T670 LSG T670, LSP T670, LSY T670, LOP T670, LYG T670 LG T671, LOG T671, LSG T671 LB T673, LV T673, LT T673, LW T673 LH T674 LS T676, LA T676, LO T676, LY T676, LB T676, LH T676, LSB T676, LW T676 LB T67C, LV T67C, LT T67C, LS T67K, LO T67K, LY T67K, LW E67C LS E67B, LA E67B, LO E67B, LY E67B, LB E67C, LV E67C, LT E67C LW T67C LS T679, LY T679, LG T679 LS T770, LO T770, LY T770, LG T770, LP T770 LB T773, LV T773, LT T773, LW T773 LH T774 LS E675, LA E675, LY E675, LS T675 LS T776, LA T776, LO T776, LY T776, LB T776 LHGB T686 LT T68C, LB T68C - Hyper Mini TOPLED® LB M676 - Mini TOPLED Santana® LG M470 LS M47K, LO M47K, LY M47K Source: http://www.osram.convergy.de LUXEON: - LUMILED® LXK2-PW12-R00, LXK2-PW12-S00, LXK2-PW14-U00, LXK2-PW14-V00 LXK2-PM12-R00, LXK2-PM12-S00, LXK2-PM14-U00 LXK2-PE12-Q00, LXK2-PE12-R00, LXK2-PE12-S00, LXK2-PE14-T00, LXK2-PE14-U00 LXK2-PB12-K00, LXK2-PB12-L00, LXK2-PB12-M00, LXK2-PB14-N00, LXK2-PB14-P00, LXK2-PB14-Q00 LXK2-PR12-L00, LXK2-PR12-M00, LXK2-PR14-Q00, LXK2-PR14-R00 LXK2-PD12-Q00, LXK2-PD12-R00, LXK2-PD12-S00 LXK2-PH12-R00, LXK2-PH12-S00 LXK2-PL12-P00, LXK2-PL12-Q00, LXK2-PL12-R00 Source: www.luxeon.com KINGBRIGHT: KA-3528ASYC Source: www.kingbright.com
MCP1 MCP2 = microchip:MCP23017: 16-Bit I/O Expander with Serial Interface
POWER = custom-350:1751248: MKDS 1/ 2-3,5 Printklemme Nennstrom: 10 A Bemessungsspannung: 160 V Raster: 3,5 mm Polzahl: 2 Montageart: Löten Anschlussart: Schraubanschluss Anschlussrichtung vom Leiter zur Platine: 0° Source: http://eshop.phoenixcontact.com .. 1751248.pdf; OC_FARNELL: unknown; OC_NEWARK: unknown
Q1-Q3 = SparkFun:MOSFET-NCHANNEL
R1-R10 R73 R74 R76 = rcl:R-EU_: RESISTOR, European symbol; SPICEPREFIX: R
R11-R72 R75 = SparkFun-Resistors:RESISTOR: Generic Resistor Package
RLSBT = jst-ph:JST-PH4
RPI-CM4 = RPI-CM4:RPI-CM4
T1-T11 = transistor:BC849: NPN TRANSISTOR
U1 = Atmel-ATMEGA328P-AU:ATMEGA328P-AU; DESCRIPTION: 8-bit Microcontroller with In-System Programmable Flash; MPN: ATMEGA328P-AU; OC_FARNELL: 1715486; OC_NEWARK: 14R4631; PACKAGE: TQFP-32; SUPPLIER: Atmel
U$5 = gaptec:GAPTECCLC78
USB0 = Custom-Connector:USB_A: USB-A Connector Male and female variants, as well as PTH and SMT variants SparkFun Products: SparkFun XBee Explorer Dongle <https://www.sparkfun.com/products/11697> PTH Male SparkFun MicroView-USB Programmer <https://www.sparkfun.com/products/12924> SMT Male SparkFun USB Type A Female Breakout <https://www.sparkfun.com/products/12700> SMT Female; PROD_ID: CONN-09520; SF_ID: PRT-09011
X2 = con-JST PHD:B26B-PHDSS: JST PHD series header 2.00mm pitch disconnectable crimp style connectors, vertical (side entry type), 26 pins
Y1 = Cristalli:0011_CSTCE16M0V53-R0: 16Mhz - SMD; MONTHLY_USAGE: _____; PART_NUMBER: CSTCE16M0V53-R0; PRICE: _____; SUPPLIER: _____; TYPE: Cristalli; VALUE: CSTCE16M0V53-R0

## Net classes
1 USB: width 0.229 mm, clearance 0.152 mm
2 HDMI: width 0.175 mm, clearance 0.152 mm